# Altium schematic sheet Connectors.SchDoc: Connectors and power filtering
size A4; Author: Daniel Berard; DrawnBy: Daniel Berard; Engineer: Daniel Berard; DocumentNumber: 4; Revision: 1; SheetNumber: 4; SheetTotal: 4; ProjectName: STM
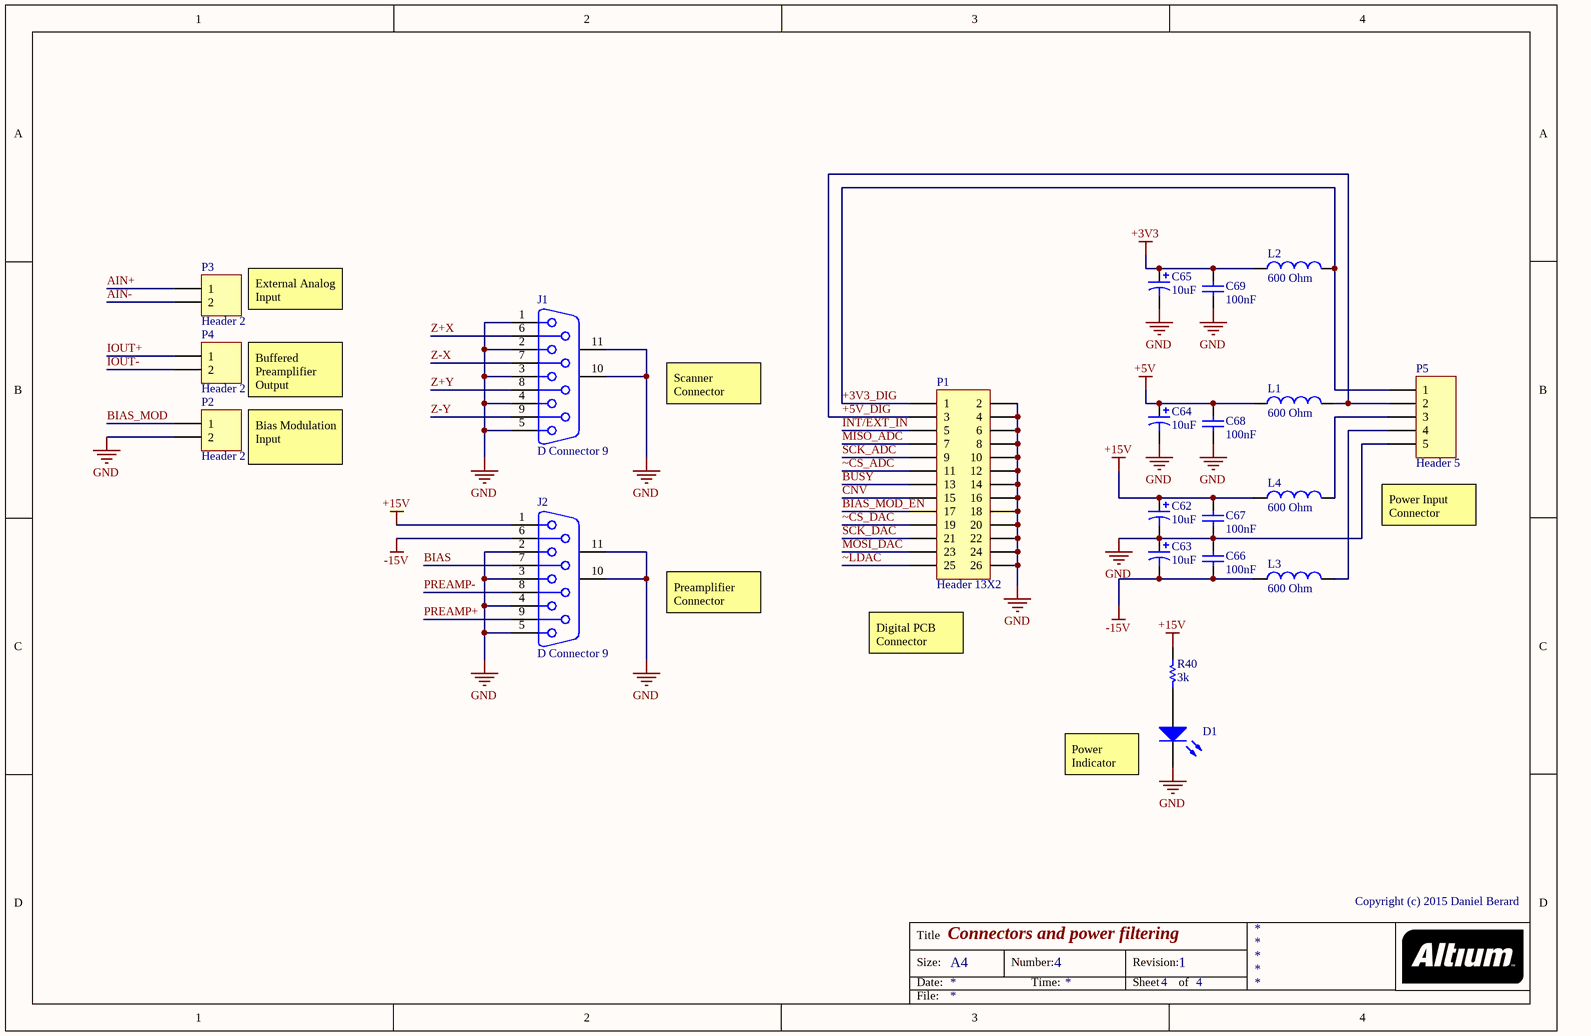
[diagram p0: Connectors.SchDoc]

## Parts
C62  10uF  [3528]
C63  10uF  [3528]
C64  10uF  [6-0805_N]
C65  10uF  [6-0805_N]
C66  100nF  [6-0805_N]
C67  100nF  [6-0805_N]
C68  100nF  [6-0805_N]
C69  100nF  [6-0805_N]
D1  (no value)  [6-0805_N]
J1  D Connector 9  [DSUB1.385-2H9]
J2  D Connector 9  [DSUB1.385-2H9]
L1  600 Ohm  [6-0805_N]
L2  600 Ohm  [6-0805_N]
L3  600 Ohm  [6-0805_N]
L4  600 Ohm  [6-0805_N]
P1  Header 13X2  [HDR2X13]
P2  Header 2  [HDR1X2]
P3  Header 2  [HDR1X2]
P4  Header 2  [HDR1X2]
P5  Header 5  [HDR1X5]
R40  3k  [6-0805_N]

## Nets
+3V3: C65.1 C69.1 L2.1
+5V: C64.1 C68.1 L1.1
+15V: C62.1 C67.1 J2.1 L4.1 R40.2
-15V: C63.2 C66.2 J2.6 L3.1
GND: C62.2 C63.1 C64.2 C65.2 C66.1 C67.2 C68.2 C69.2 D1.2(K) J1.1 J1.2 J1.3 J1.4 J1.5 J1.10(MH1) J1.11(MH2) J2.2 J2.3 J2.4 J2.5 J2.10(MH1) J2.11(MH2) P1.2 P1.4 P1.6 P1.8 P1.10 P1.12 P1.14 P1.16 P1.18 P1.20 P1.22 P1.24 P1.26 P2.2 P5.5
+3V3_DIG: L2.2 P1.1 P5.1
+5V_DIG: L1.2 P1.3 P5.2
AIN+: P3.1
AIN-: P3.2
BIAS: J2.7
BIAS_MOD: P2.1
BIAS_MOD_EN: P1.17
BUSY: P1.13
CNV: P1.15
INT/EXT_IN: P1.5
IOUT+: P4.1
IOUT-: P4.2
MISO_ADC: P1.7
MOSI_DAC: P1.23
PREAMP+: J2.9
PREAMP-: J2.8
SCK_ADC: P1.9
SCK_DAC: P1.21
Z+X: J1.6
Z+Y: J1.8
Z-X: J1.7
Z-Y: J1.9
~CS_ADC: P1.11
~CS_DAC: P1.19
~LDAC: P1.25
NetD1_1: D1.1(A) R40.1
NetL3_2: L3.2 P5.4
NetL4_2: L4.2 P5.3

## Notes on the sheet
- External Analog Input
- Buffered Preamplifier Output
- Scanner Connector
- Bias Modulation Input
- Power Input Connector
- Preamplifier Connector
- (near P1) Digital PCB Connector
- (near D1) Power Indicator
- Copyright (c) 2015 Daniel Berard
- Title
- Size:
- Date:
- A4
- Number:
- Time:
- Revision:
- Sheet
- of
- File:

## Library data of the parts
C62-C65 = Cap Pol1: Polarized Capacitor (Radial); Value: 100pF; Published: 8-Jun-2000; LatestRevisionDate: 17-Jul-2002; LatestRevisionNote: Re-released for DXP Platform.; PackageReference: RB7.6-15; Publisher: Altium Limited; PackageDescription: Polarized Capacitor (Radial); 2 Leads
C66-C69 = Cap: Capacitor; Value: 100pF; Published: 8-Jun-2000; LatestRevisionDate: 17-Jul-2002; LatestRevisionNote: Re-released for DXP Platform.; PackageReference: RAD-0.3; Publisher: Altium Limited; PackageDescription: Radial Cap, Thru-Hole; 2 Leads; 0.3 in Pin Spacing
D1 = LED0: Typical INFRARED GaAs LED; Published: 8-Jun-2000; LatestRevisionDate: 08-Jul-2005; LatestRevisionNote: Mech Layer 1 removed.; PackageReference: LED-0; Publisher: Altium Limited; PackageDescription: LED; 2 Leads
J1 J2 = D Connector 9: Receptacle Assembly, 9 Position, Right Angle; PackageDocument: O; Positions: 9; Published: 15-Jun-2001; LatestRevisionDate: 17-Jul-2002; LatestRevisionNote: Re-released for DXP Platform.; DatasheetDocument: 1-Sep-1999; PackageReference: 788750; Publisher: Altium Limited; Orientation: Right Angle; Gender: Receptacle
L1-L4 = Inductor: Code_IEC: 1005; Value: 10mH; Published: 8-Jun-2000; LatestRevisionDate: 29-May-2009; LatestRevisionNote: IPC-7351 Footprint Added.; PackageReference: 0402-A; Publisher: Altium Limited; PackageDescription: Chip Inductor; Code_JEITA: 0402
P1 = Header 13X2: Header, 13-Pin, Dual row; LatestRevisionDate: 17-Jul-2002; LatestRevisionNote: Re-released for DXP Platform.; Publisher: Altium Limited
P2-P4 = Header 2: Header, 2-Pin; LatestRevisionDate: 17-Jul-2002; LatestRevisionNote: Re-released for DXP Platform.; Publisher: Altium Limited
P5 = Header 5: Header, 5-Pin; LatestRevisionDate: 17-Jul-2002; LatestRevisionNote: Re-released for DXP Platform.; Publisher: Altium Limited
R40 = Res1: Resistor; Value: 1K; Published: 8-Jun-2000; LatestRevisionDate: 17-Jul-2002; LatestRevisionNote: Re-released for DXP Platform.; PackageReference: AXIAL-0.3; Publisher: Altium Limited; PackageDescription: Axial Device, Thru-Hole; 2 Leads; 0.3 in Pin Spacing